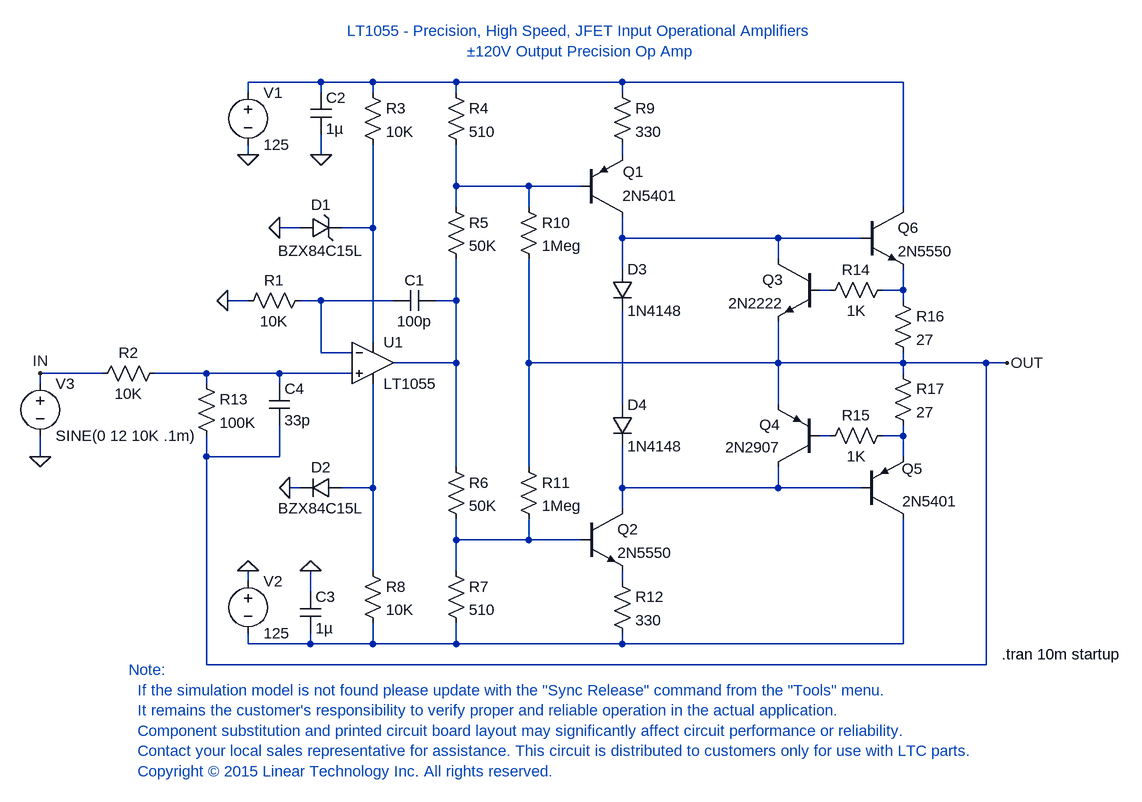
[diagram p0: schematic LT1055_TA10.asc]
LT1055_TA10.asc, the LTspice schematic file:
Version 4
SHEET 1 1640 876
WIRE 224 -240 112 -240
WIRE 304 -240 224 -240
WIRE 432 -240 304 -240
WIRE 688 -240 432 -240
WIRE 1120 -240 688 -240
WIRE 112 -224 112 -240
WIRE 224 -224 224 -240
WIRE 304 -224 304 -240
WIRE 432 -224 432 -240
WIRE 688 -224 688 -240
WIRE 112 -128 112 -144
WIRE 224 -128 224 -160
WIRE 688 -128 688 -144
WIRE 432 -80 432 -144
WIRE 544 -80 432 -80
WIRE 624 -80 544 -80
WIRE 432 -48 432 -80
WIRE 544 -48 544 -80
WIRE 1120 -48 1120 -240
WIRE 192 -16 160 -16
WIRE 304 -16 304 -144
WIRE 304 -16 256 -16
WIRE 688 0 688 -32
WIRE 928 0 688 0
WIRE 1056 0 928 0
WIRE 928 32 928 0
WIRE 688 48 688 0
WIRE 1008 80 992 80
WIRE 1120 80 1120 48
WIRE 1120 80 1088 80
WIRE 112 96 80 96
WIRE 224 96 192 96
WIRE 336 96 224 96
WIRE 432 96 432 32
WIRE 432 96 400 96
WIRE 1120 96 1120 80
WIRE 304 160 304 -16
WIRE 224 176 224 96
WIRE 272 176 224 176
WIRE 432 192 432 96
WIRE 432 192 336 192
WIRE 544 192 544 32
WIRE 928 192 928 128
WIRE 928 192 544 192
WIRE 1120 192 1120 176
WIRE 1120 192 928 192
WIRE 1248 192 1120 192
WIRE 1280 192 1248 192
WIRE -112 208 -208 208
WIRE 48 208 -32 208
WIRE 160 208 48 208
WIRE 272 208 160 208
WIRE 1120 208 1120 192
WIRE -208 224 -208 208
WIRE 48 224 48 208
WIRE 160 224 160 208
WIRE 688 256 688 112
WIRE 928 256 928 192
WIRE 1008 304 992 304
WIRE 1120 304 1120 288
WIRE 1120 304 1088 304
WIRE -208 336 -208 304
WIRE 48 336 48 304
WIRE 160 336 160 288
WIRE 160 336 48 336
WIRE 1120 336 1120 304
WIRE 432 352 432 192
WIRE 544 352 544 192
WIRE 192 384 176 384
WIRE 304 384 304 224
WIRE 304 384 256 384
WIRE 688 384 688 320
WIRE 928 384 928 352
WIRE 928 384 688 384
WIRE 1056 384 928 384
WIRE 688 416 688 384
WIRE 432 464 432 432
WIRE 544 464 544 432
WIRE 544 464 432 464
WIRE 624 464 544 464
WIRE 304 512 304 384
WIRE 432 512 432 464
WIRE 112 528 112 512
WIRE 688 528 688 512
WIRE 208 544 208 512
WIRE 112 624 112 608
WIRE 208 624 208 608
WIRE 208 624 112 624
WIRE 304 624 304 592
WIRE 304 624 208 624
WIRE 432 624 432 592
WIRE 432 624 304 624
WIRE 688 624 688 608
WIRE 688 624 432 624
WIRE 1120 624 1120 432
WIRE 1120 624 688 624
WIRE 48 656 48 336
WIRE 1248 656 1248 192
WIRE 1248 656 48 656
FLAG -208 208 IN
FLAG 80 96 0
FLAG 160 -16 0
FLAG 224 -128 0
FLAG 112 -128 0
FLAG 208 512 0
FLAG 176 384 0
FLAG 112 512 0
FLAG -208 336 0
FLAG 1280 192 OUT
SYMBOL LT1055 304 128 R0
SYMATTR InstName U1
SYMBOL res 208 80 R90
WINDOW 0 0 56 VBottom 2
WINDOW 3 32 56 VTop 2
SYMATTR InstName R1
SYMATTR Value 10K
SYMBOL res -16 192 R90
WINDOW 0 0 56 VBottom 2
WINDOW 3 32 56 VTop 2
SYMATTR InstName R2
SYMATTR Value 10K
SYMBOL cap 400 80 R90
WINDOW 0 0 32 VBottom 2
WINDOW 3 32 32 VTop 2
SYMATTR InstName C1
SYMATTR Value 100p
SYMBOL zener 192 0 R270
WINDOW 0 36 32 VTop 2
WINDOW 3 -4 32 VBottom 2
SYMATTR InstName D1
SYMATTR Value BZX84C15L
SYMATTR Description Diode
SYMATTR Type diode
SYMBOL res 288 -240 R0
SYMATTR InstName R3
SYMATTR Value 10K
SYMBOL cap 208 -224 R0
SYMATTR InstName C2
SYMATTR Value 1µ
SYMBOL res 416 -240 R0
SYMATTR InstName R4
SYMATTR Value 510
SYMBOL res 416 -64 R0
SYMATTR InstName R5
SYMATTR Value 50K
SYMBOL res 416 336 R0
SYMATTR InstName R6
SYMATTR Value 50K
SYMBOL res 416 496 R0
SYMATTR InstName R7
SYMATTR Value 510
SYMBOL res 288 496 R0
SYMATTR InstName R8
SYMATTR Value 10K
SYMBOL voltage 112 -240 R0
WINDOW 123 0 0 Left 2
WINDOW 39 0 0 Left 2
SYMATTR InstName V1
SYMATTR Value 125
SYMBOL res 672 -240 R0
SYMATTR InstName R9
SYMATTR Value 330
SYMBOL res 528 -64 R0
SYMATTR InstName R10
SYMATTR Value 1Meg
SYMBOL res 528 336 R0
SYMATTR InstName R11
SYMATTR Value 1Meg
SYMBOL res 672 512 R0
SYMATTR InstName R12
SYMATTR Value 330
SYMBOL cap 192 608 M180
WINDOW 0 24 56 Left 2
WINDOW 3 24 8 Left 2
SYMATTR InstName C3
SYMATTR Value 1µ
SYMBOL diode 256 368 R90
WINDOW 0 0 32 VBottom 2
WINDOW 3 32 32 VTop 2
SYMATTR InstName D2
SYMATTR Value BZX84C15L
SYMBOL voltage 112 512 R0
WINDOW 123 0 0 Left 2
WINDOW 39 0 0 Left 2
SYMATTR InstName V2
SYMATTR Value 125
SYMBOL pnp 624 -32 M180
WINDOW 0 65 70 Left 2
WINDOW 3 64 33 Left 2
SYMATTR InstName Q1
SYMATTR Value 2N5401
SYMBOL npn 624 416 R0
SYMATTR InstName Q2
SYMATTR Value 2N5550
SYMBOL diode 672 48 R0
SYMATTR InstName D3
SYMATTR Value 1N4148
SYMBOL diode 672 256 R0
SYMATTR InstName D4
SYMATTR Value 1N4148
SYMBOL res 32 208 R0
SYMATTR InstName R13
SYMATTR Value 100K
SYMBOL cap 144 224 R0
SYMATTR InstName C4
SYMATTR Value 33p
SYMBOL voltage -208 208 R0
WINDOW 123 0 0 Left 2
WINDOW 39 0 0 Left 2
SYMATTR InstName V3
SYMATTR Value SINE(0 12 10K .1m)
SYMBOL npn 992 32 M0
SYMATTR InstName Q3
SYMATTR Value 2N2222
SYMBOL pnp 992 352 R180
WINDOW 0 61 65 Left 2
WINDOW 3 61 30 Left 2
SYMATTR InstName Q4
SYMATTR Value 2N2907
SYMBOL res 1104 64 R90
WINDOW 0 0 56 VBottom 2
WINDOW 3 32 56 VTop 2
SYMATTR InstName R14
SYMATTR Value 1K
SYMBOL res 1104 288 R90
WINDOW 0 0 56 VBottom 2
WINDOW 3 32 56 VTop 2
SYMATTR InstName R15
SYMATTR Value 1K
SYMBOL res 1104 80 R0
SYMATTR InstName R16
SYMATTR Value 27
SYMBOL res 1104 192 R0
SYMATTR InstName R17
SYMATTR Value 27
SYMBOL pnp 1056 432 M180
WINDOW 0 62 77 Left 2
WINDOW 3 63 27 Left 2
SYMATTR InstName Q5
SYMATTR Value 2N5401
SYMBOL npn 1056 -48 R0
SYMATTR InstName Q6
SYMATTR Value 2N5550
TEXT 1272 640 Left 2 !.tran 10m startup
TEXT 624 -272 Bottom 2 ;LT1055 - Precision, High Speed, JFET Input Operational Amplifiers\n±120V Output Precision Op Amp
TEXT -72 664 Left 2 ;Note:\n  If the simulation model is not found please update with the "Sync Release" command from the "Tools" menu.\n  It remains the customer's responsibility to verify proper and reliable operation in the actual application.\n  Component substitution and printed circuit board layout may significantly affect circuit performance or reliability.\n  Contact your local sales representative for assistance. This circuit is distributed to customers only for use with LTC parts.\n  Copyright © 2015 Linear Technology Inc. All rights reserved.

The netlist it stands for:
* LT1055_TA10.asc
* U1: LT1055 (symbol LT1055 not available, pins judged from their places): In+=N010 In-=N008 V+=N004 V-=N014 OUT=N009
R1 N008 0 10K
R2 N010 IN 10K
C1 N009 N008 100p
D1 0 N004 BZX84C15L
R3 N001 N004 10K
C2 N001 0 1µ
R4 N001 N003 510
R5 N003 N009 50K
R6 N009 N016 50K
R7 N016 N018 510
R8 N014 N018 10K
V1 N001 0 125
R9 N001 N002 330
R10 N003 OUT 1Meg
R11 OUT N016 1Meg
R12 N017 N018 330
C3 N018 0 1µ
D2 N014 0 BZX84C15L
V2 0 N018 125
Q1 N005 N003 N002 0 2N5401
Q2 N015 N016 N017 0 2N5550
D3 N005 N011 1N4148
D4 N011 N015 1N4148
R13 N010 OUT 100K
C4 N010 OUT 33p
V3 IN 0 SINE(0 12 10K .1m)
Q3 N005 N006 OUT 0 2N2222
Q4 N015 N012 OUT 0 2N2907
R14 N007 N006 1K
R15 N013 N012 1K
R16 N007 OUT 27
R17 OUT N013 27
Q5 N018 N015 N013 0 2N5401
Q6 N001 N005 N007 0 2N5550
.model D D
.lib standard.dio
.model NPN NPN
.model PNP PNP
.lib standard.bjt
.tran 10m startup
* LT1055 - Precision, High Speed, JFET Input Operational Amplifiers
* ±120V Output Precision Op Amp
* Note:
*   If the simulation model is not found please update with the "Sync Release" command from the "Tools" menu.
*   It remains the customer's responsibility to verify proper and reliable operation in the actual application.
*   Component substitution and printed circuit board layout may significantly affect circuit performance or reliability.
*   Contact your local sales representative for assistance. This circuit is distributed to customers only for use with LTC parts.
*   Copyright © 2015 Linear Technology Inc. All rights reserved.
.backanno
.end